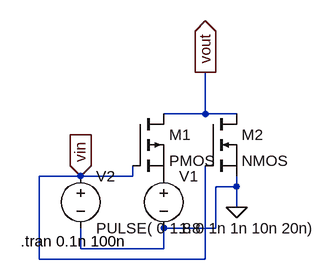
[diagram p0: schematic ltsipce_inverter.asc]
ltsipce_inverter.asc, the LTspice schematic file:
Version 4
SHEET 1 880 680
WIRE 272 -16 272 -80
WIRE 272 -16 208 -16
WIRE 320 -16 272 -16
WIRE 80 80 16 80
WIRE 160 80 160 64
WIRE 160 80 80 80
WIRE 320 96 320 80
WIRE 320 96 288 96
WIRE 320 128 320 96
WIRE 288 160 288 96
WIRE 288 160 208 160
WIRE 80 192 80 160
WIRE 208 192 208 160
WIRE 208 192 80 192
WIRE 16 208 16 80
WIRE 272 208 272 64
WIRE 272 208 16 208
FLAG 320 128 0
FLAG 80 80 vin
IOPIN 80 80 In
FLAG 272 -80 vout
IOPIN 272 -80 Out
SYMBOL pmos 160 -16 R0
SYMATTR InstName M1
SYMBOL nmos 272 -16 R0
SYMATTR InstName M2
SYMBOL voltage 208 64 R0
WINDOW 123 0 0 Left 0
WINDOW 39 0 0 Left 0
SYMATTR InstName V1
SYMATTR Value 1.8
SYMBOL voltage 80 64 R0
WINDOW 123 0 0 Left 0
WINDOW 39 0 0 Left 0
SYMATTR InstName V2
SYMATTR Value PULSE( 0 1.8 0 1n 1n 10n 20n)
TEXT -12 180 Left 2 !.tran 0.1n 100n

The netlist it stands for:
* ltsipce_inverter.asc
M1 vout vin P001 P001 PMOS
M2 vout vin 0 0 NMOS
V1 P001 0 1.8
V2 vin 0 PULSE( 0 1.8 0 1n 1n 10n 20n)
.model NMOS NMOS
.model PMOS PMOS
.lib standard.mos
.tran 0.1n 100n
.backanno
.end